# EAGLE design spot-welding (EAGLE 8.3.1)
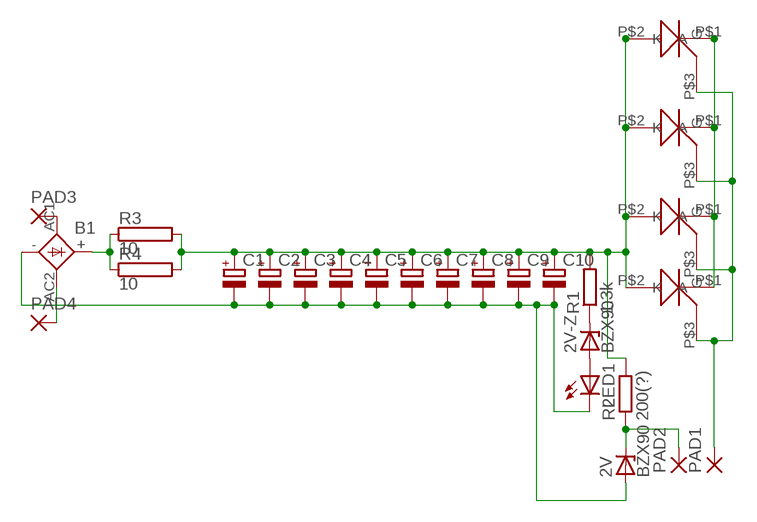
[diagram p0: schematic, sheet 1]

## Parts
2V  BZX90  [DO34Z7]
2V-Z  BZX90  [DO34Z7]
B1  KBU  [KBU]
C1  CPOL-EUE10-30  [EB30D]
C2  CPOL-EUE10-30  [EB30D]
C3  CPOL-EUE10-30  [EB30D]
C4  CPOL-EUE10-30  [EB30D]
C5  CPOL-EUE10-30  [EB30D]
C6  CPOL-EUE10-30  [EB30D]
C7  CPOL-EUE10-30  [EB30D]
C8  CPOL-EUE10-30  [EB30D]
C9  CPOL-EUE10-30  [EB30D]
C10  CPOL-EUE10-30  [EB30D]
LED1  LED3MM  [LED3MM]
PAD1  3,17/1,1  [3,17/1,1]
PAD2  3,17/1,1  [3,17/1,1]
PAD3  3,17/1,1  [3,17/1,1]
PAD4  3,17/1,1  [3,17/1,1]
R1  1.3k  R-EU_0204/7  [0204/7]
R2  200(?)  R-EU_0204/7  [0204/7]
R3  10  RKH214-8R  [KH214R-8]
R4  10  RKH214-8R  [KH214R-8]
U$1  40TPS12  [40TPS12]
U$2  40TPS12  [40TPS12]
U$3  40TPS12  [40TPS12]
U$4  40TPS12  [40TPS12]

## Nets
N$2: 2V.A B1.- C1.- C2.- C3.- C4.- C5.- C6.- C7.- C8.- C9.- C10.- LED1.K(C)
N$3: 2V-Z.C R1.1
N$4: PAD1.1(P) U$1.P$3(G) U$2.P$3(G) U$3.P$3(G) U$4.P$3(G)
N$5: U$1.P$1(K) U$2.P$1(K) U$3.P$1(K) U$4.P$1(K)
N$6: 2V-Z.A LED1.A
N$7: 2V.C PAD2.1(P) R2.1
N$10: C1.+ C2.+ C3.+ C4.+ C5.+ C6.+ C7.+ C8.+ C9.+ C10.+ R1.2 R2.2 R3.2 R4.2 U$1.P$2(A) U$2.P$2(A) U$3.P$2(A) U$4.P$2(A)
N$11: B1.+ R3.1 R4.1
N$13: B1.AC1 PAD3.1(P)
N$14: B1.AC2 PAD4.1(P)

## Library data of the parts
2V 2V-Z = diode:BZX90: Z DIODE
B1 = rectifier:KBU: DIOTEC RECTIFIER
C1-C10 = resistor:CPOL-EU: POLARIZED CAPACITOR, European symbol
LED1 = led:LED: LED OSRAM: - CHIPLED LG R971, LG N971, LY N971, LG Q971, LY Q971, LO R971, LY R971 LH N974, LH R974 LS Q976, LO Q976, LY Q976 LO Q996 - Hyper CHIPLED LW Q18S LB Q993, LB Q99A, LB R99A - SideLED LS A670, LO A670, LY A670, LG A670, LP A670 LB A673, LV A673, LT A673, LW A673 LH A674 LY A675 LS A676, LA A676, LO A676, LY A676, LW A676 LS A679, LY A679, LG A679 - Hyper Micro SIDELED® LS Y876, LA Y876, LO Y876, LY Y876 LT Y87S - SmartLED LW L88C, LW L88S LB L89C, LB L89S, LG L890 LS L89K, LO L89K, LY L89K LS L896, LA L896, LO L896, LY L896 - TOPLED LS T670, LO T670, LY T670, LG T670, LP T670 LSG T670, LSP T670, LSY T670, LOP T670, LYG T670 LG T671, LOG T671, LSG T671 LB T673, LV T673, LT T673, LW T673 LH T674 LS T676, LA T676, LO T676, LY T676, LB T676, LH T676, LSB T676, LW T676 LB T67C, LV T67C, LT T67C, LS T67K, LO T67K, LY T67K, LW E67C LS E67B, LA E67B, LO E67B, LY E67B, LB E67C, LV E67C, LT E67C LW T67C LS T679, LY T679, LG T679 LS T770, LO T770, LY T770, LG T770, LP T770 LB T773, LV T773, LT T773, LW T773 LH T774 LS E675, LA E675, LY E675, LS T675 LS T776, LA T776, LO T776, LY T776, LB T776 LHGB T686 LT T68C, LB T68C - Hyper Mini TOPLED® LB M676 - Mini TOPLED Santana® LG M470 LS M47K, LO M47K, LY M47K Source: http://www.osram.convergy.de LUXEON: - LUMILED® LXK2-PW12-R00, LXK2-PW12-S00, LXK2-PW14-U00, LXK2-PW14-V00 LXK2-PM12-R00, LXK2-PM12-S00, LXK2-PM14-U00 LXK2-PE12-Q00, LXK2-PE12-R00, LXK2-PE12-S00, LXK2-PE14-T00, LXK2-PE14-U00 LXK2-PB12-K00, LXK2-PB12-L00, LXK2-PB12-M00, LXK2-PB14-N00, LXK2-PB14-P00, LXK2-PB14-Q00 LXK2-PR12-L00, LXK2-PR12-M00, LXK2-PR14-Q00, LXK2-PR14-R00 LXK2-PD12-Q00, LXK2-PD12-R00, LXK2-PD12-S00 LXK2-PH12-R00, LXK2-PH12-S00 LXK2-PL12-P00, LXK2-PL12-Q00, LXK2-PL12-R00 Source: www.luxeon.com KINGBRIGHT: KA-3528ASYC Source: www.kingbright.com
PAD1-PAD4 = wirepad:3,17/1,1: THROUGH-HOLE PAD
R1 R2 = resistor:R-EU_: RESISTOR, European symbol
R3 R4 = resistor-power:R: Power Resitor; OC_FARNELL: unknown; OC_NEWARK: unknown
U$1-U$4 = mgvc:40TPS12: Thyristor High Voltage, Phase Control SCR, 40 A

## Board
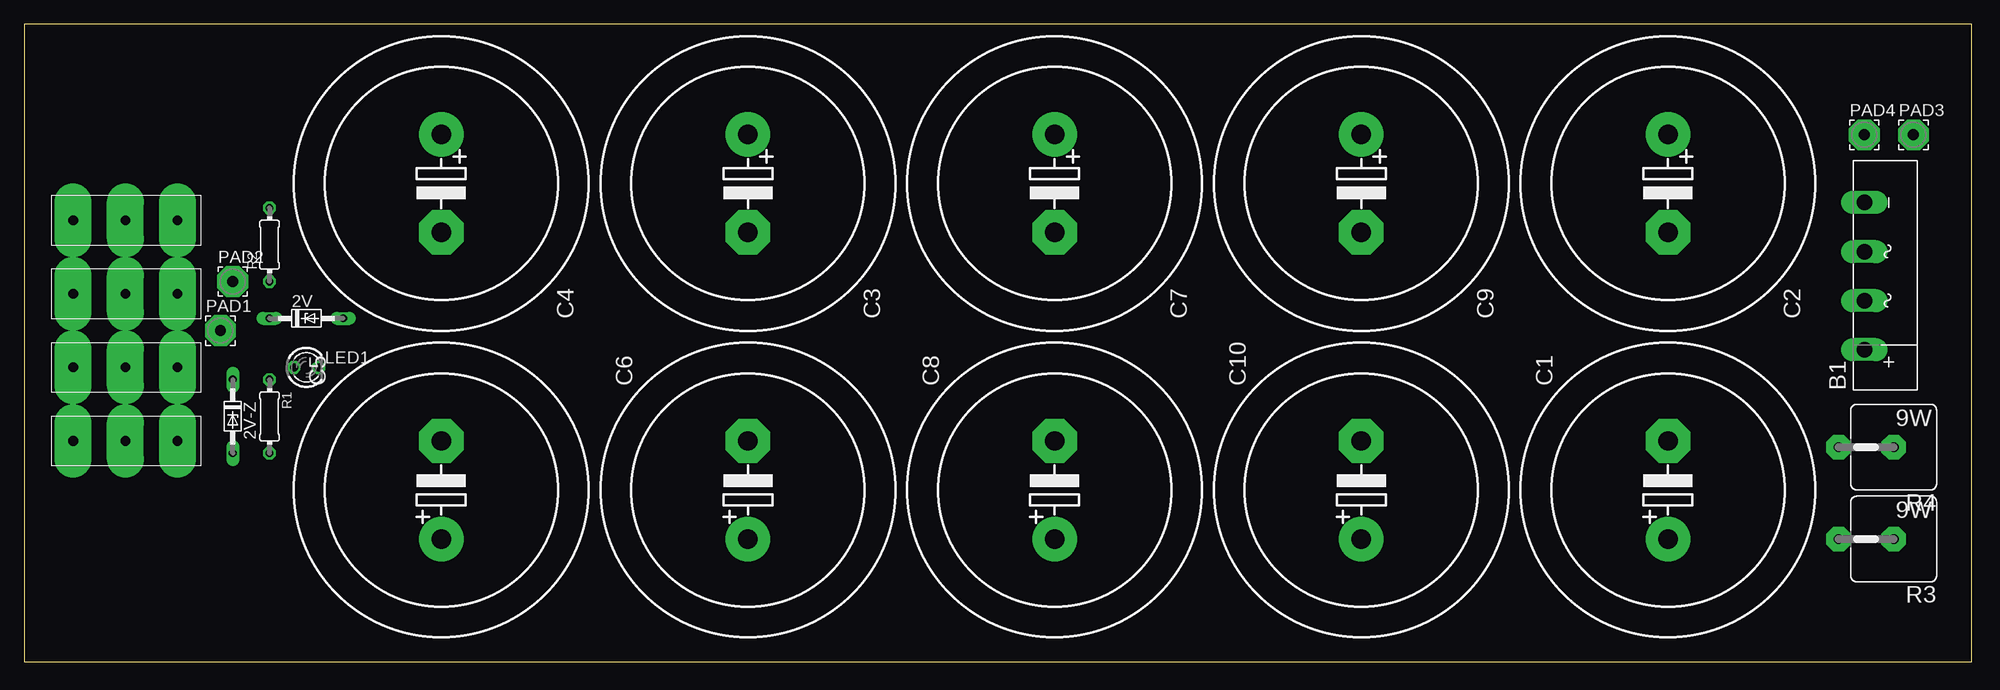
[diagram p1: board, top side]
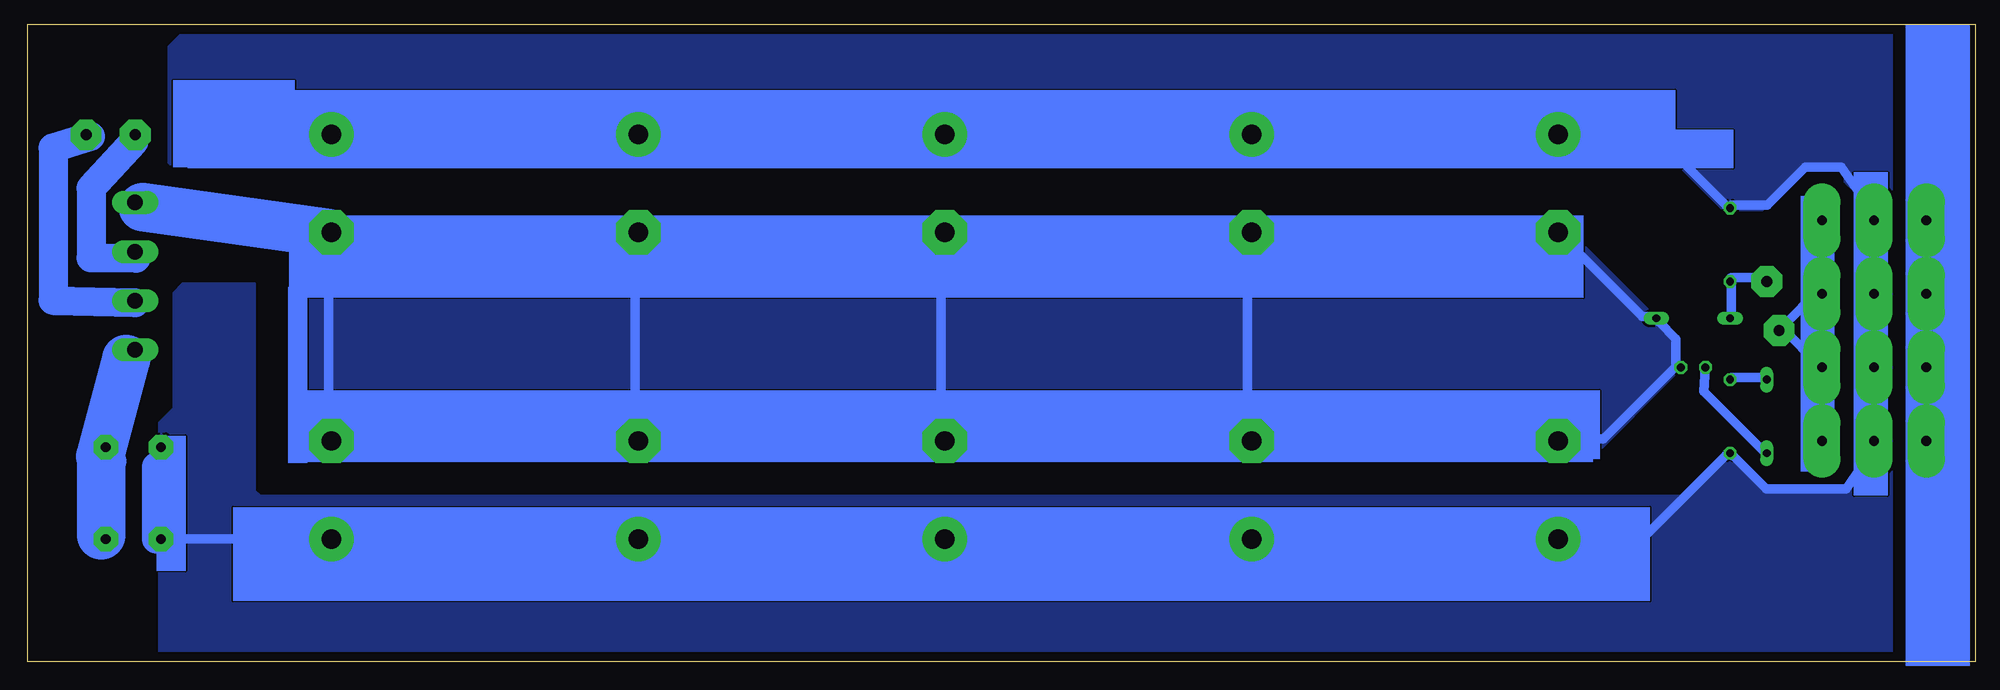
[diagram p2: board, bottom side, seen from below]

Size 201.6 x 66.03 mm. Coordinates in mm from the lower left corner, seen from the top.
Outline: 0,0 201.6,0 201.6,66.03 0,66.03 0,0
Copper layers (1*16): Top 0.035mm / dielectric 1.5mm / Bottom 0.035mm
Design rules "default *": minimum track width 1mm, minimum drill 0.35mm, track to track 6mil, track to pad 6mil, pad to pad 6mil, via to via 6mil, smd to smd 6mil, copper to edge 40mil, drill to drill 6mil, minimum pad ring 10mil, minimum via ring 8mil, stop-mask expansion 4mil, vias tented up to drill 0mil, thermal gap 10mil

### Footprints (pad centres in the part's own frame; a part is rotated, then mirrored left to right if it is on the bottom)
DO34Z7 = drill 0.813 long: A 3.81,0; C -3.81,0
KBU = drill 1.6 long: + -7.62,2.54; - 7.62,2.54; AC1 -2.54,2.54; AC2 2.54,2.54
EB30D = drill 2.007 pad 4.597: + -5.08,0 | drill 2.007 pad 4.597 octagon: - 5.08,0
LED3MM = drill 0.813 octagon: A -1.27,0; K 1.27,0
3,17/1,1 = drill 1.118 pad 3.175 octagon: 1 0,0
0204/7 = drill 0.813 octagon: 1 -3.81,0; 2 3.81,0
KH214R-8 = drill 1.016 pad 2.54 octagon: 1 -2.54,0; 2 3.175,0
40TPS12 = drill 1 pad 3.81 long: P$1 0,0; P$2 5.4,0; P$3 10.8,0

### Placement (x,y rotation side)
2V  29.21,35.56 0 top
2V-Z  21.59,25.4 270 top
B1  193.04,39.93 90 top
C1  170.18,17.78 90 top
C2  170.18,49.53 270 top
C3  74.93,49.53 270 top
C4  43.18,49.53 270 top
C5  43.18,17.78 90 top
C6  74.93,17.78 90 top
C7  106.68,49.53 270 top
C8  106.68,17.78 90 top
C9  138.43,49.53 270 top
C10  138.43,17.78 90 top
LED1  29.21,30.48 0 top
PAD1  20.32,34.29 0 top
PAD2  21.59,39.37 0 top
PAD3  195.58,54.57 0 top
PAD4  190.5,54.57 0 top
R1  25.4,25.4 270 top
R2  25.4,43.18 90 top
R3  191,12.7 180 top
R4  191,22.22 180 top
U$1  5.08,45.72 0 top
U$2  5.08,38.1 0 top
U$3  5.08,30.48 0 top
U$4  5.08,22.86 0 top

### Tracks (layer width: path | path; a pad name or v marks a point on that pad's centre or on a via)
N$2
  Bottom 1: 138.76,23.07 138.76,44.39 C9.- | 138.76,23.07 169.87,23.07 C1.- 170.45,23.07 170.45,44.39 C2.- | 138.76,23.07 C10.- 138.18,23.07 107.07,23.07 | 31.01,30.56 31.01,33.44 32.74,35.17 2V.A 33.31,35.75 34.47,35.75 43.11,44.39 C4.- | 31.01,30.56 38.5,23.07 43.11,23.07 C5.- 43.68,23.07 74.8,23.07 C6.- 75.38,23.07 | 31.01,30.56 LED1.K | 75.38,23.07 75.38,44.39 C3.- | 107.07,23.07 107.07,44.39 C7.- | 75.38,23.07 106.49,23.07 C8.- 107.07,23.07 | 189.74,47.09 B1.-
  Bottom 5: 170.45,44.39 189.74,47.09
  pour Bottom: 172.58,20.7 173.08,20.7 173.08,46.2 41.58,46.2 41.58,45.7 41.58,44.2 32.58,35.2 30.58,33.2 30.58,30.7 30.58,30.2 40.08,20.7
N$3
  Bottom 1: 2V-Z.C 21.79,29.41 25.25,29.41 R1.1
N$4
  Bottom 1: U$4.P$3 16.03,23.07 16.03,29.99 U$3.P$3 16.03,30.56 20.06,34.6 | 16.03,38.63 20.06,34.6 | 16.03,38.63 16.03,45.54 U$1.P$3 | 16.03,38.63 U$2.P$3 | 20.06,34.6 PAD1.1
N$5
  Bottom 1: U$4.P$1 U$3.P$1 U$2.P$1 U$1.P$1
  pour Bottom: 0.08,-0.3 7.08,-0.3 7.08,66.2 0.08,66.2
N$6
  Bottom 1: 2V-Z.A 21.79,21.92 21.79,21.65 28.13,27.99 LED1.A
N$7
  Bottom 1: 2V.C 25.25,35.75 25.25,39.2 R2.1 25.25,39.78 21.79,39.78 PAD2.1
N$10
  Bottom 1: C2.+ 169.87,54.76 138.76,54.76 C9.+ 138.18,54.76 107.07,54.76 C7.+ 106.49,54.76 75.38,54.76 C3.+ 74.8,54.76 43.68,54.76 C4.+ 43.11,54.19 32.74,54.19 25.82,47.27 R2.2 25.25,47.27 21.56,47.27 17.6,51.23 13.88,51.23 10.27,46.12 U$1.P$2 10.84,45.54 10.84,38.63 U$2.P$2 10.84,38.05 10.84,30.56 U$3.P$2 10.84,29.99 10.84,23.07 U$4.P$2 10.27,22.49 13.38,17.89 21.64,17.89 25.09,21.34 25.25,21.34 R1.2 25.82,21.34 34.47,12.7 C5.+ C6.+ C8.+ C10.+ C1.+ R3.2 188.31,12.7 | 188.31,20.19 R4.2
  Bottom 3: 188.31,20.19 188.31,12.7
  pour Bottom: 185.58,39.2 178.08,39.2 178.08,17.7 177.58,17.2 29.58,17.2 26.08,20.7 25.08,20.7 22.08,17.7 13.58,17.7 13.58,18.2 12.08,19.7 12.08,45.2 9.58,45.2 8.58,44.2 8.58,0.2 9.08,-0.3 187.08,-0.3 188.08,0.7 188.08,24.7 186.58,26.2 186.58,38.2
  pour Bottom: 33.08,53.2 32.58,53.2 26.08,46.7 22.08,46.7 21.58,47.2 17.58,51.2 13.58,51.2 13.58,49.7 11.58,47.7 9.58,47.7 9.08,47.2 8.58,46.7 8.58,65.7 185.08,65.7 185.58,65.2 187.08,63.7 187.08,51.7 186.58,51.2 35.08,51.2
N$11
  Bottom 1: 191.42,31.33 B1.+ | 192.92,20.77 R4.1 194,20.59 | 194,13.1 R3.1
  Bottom 3: 192.92,20.77 194.12,21.27
  Bottom 5: 194.12,21.27 191.42,31.33 | 194,20.59 194,13.1
N$13
  Bottom 1: 190.52,37.2 B1.AC1 | 195.15,54.38 PAD3.1
  Bottom 3: 190.52,37.2 199,37.41 199,53.2 195.15,54.38
N$14
  Bottom 1: 190.42,41.78 B1.AC2 | 190.62,53.88 PAD4.1
  Bottom 3: 190.42,41.78 195.07,41.84 195.07,49.02 190.62,53.88
(copper drawn outside any net)
  shapes: Bottom area x14